# Altium schematic sheet SMPS-5V.SchDoc
size A
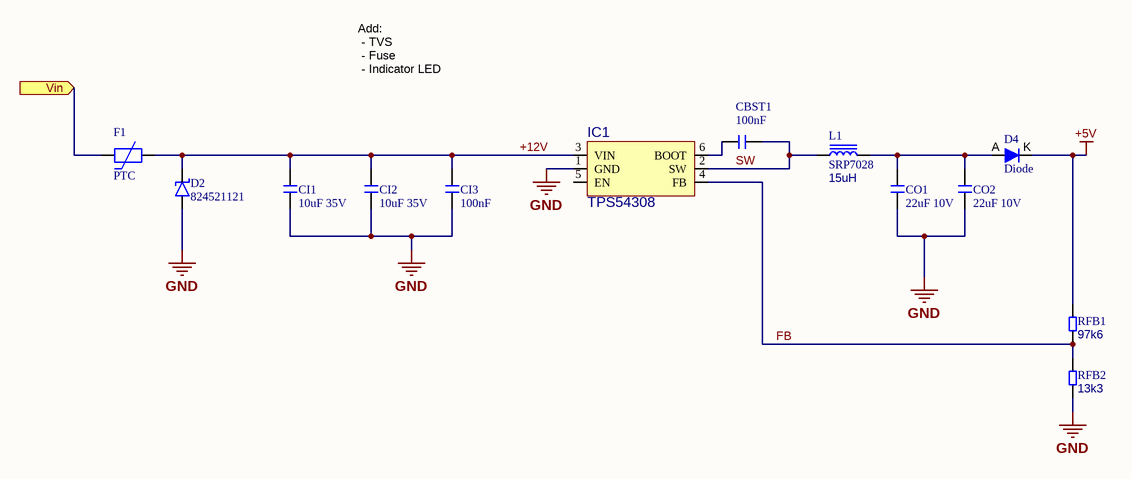
[diagram p0: SMPS-5V.SchDoc]

## Parts
CBST1  100nF  [C0603_N]
CI1  10uF 35V  [C1210_N]
CI2  10uF 35V  [C1210_N]
CI3  100nF  [C0603_N]
CO1  22uF 10V  [C1210_N]
CO2  22uF 10V  [C1210_N]
D2  824521121  [DO214AC SMA]
D4  Diode  [SOD323F]
F1  PTC  [C1206_N]
IC1  TPS54308  [SOT23]
L1  SRP7028  value 15uH  [Inductor SRP7028]
RFB1  value 97k6  [R0603]  (hidden comment: 100k)
RFB2  value 13k3  [R0603]  (hidden comment: 13k5)

## Ports
Vin (in)

## Nets
+5V: D4.K RFB1.2
GND: CI1.2 CI2.2 CI3.2 CO1.2 CO2.2 D2.1 IC1.1(GND) RFB2.1
+12V: CI1.1 CI2.1 CI3.1 D2.2 F1.2 IC1.3(VIN)
FB: IC1.4(FB) RFB1.1 RFB2.2
SW: CBST1.2 IC1.2(SW) L1.1
Vin: F1.1 ; port Vin
NetCBST1_1: CBST1.1 IC1.6(BOOT)
NetCO1_1: CO1.1 CO2.1 D4.A L1.2

Not connected (* = marked no-connect by the designer): IC1 5(EN)

## Notes on the sheet
- Add:
  - TVS
  - Fuse
  - Indicator LED

## Library data of the parts
CBST1 CI1 CI2 CO1 CO2 = Capacitor: Capacitor MLCC; Manufacturer: Yageo; Manufacturer Part Number: CC0603KRX7R9BB104; Tolerance (%): 10; Category: Capacitor; Package: 0603; Supplier Part Number 1: 1362556; Supplier 1: Farnell; ComponentLink1URL: http://www.yageo.com; ComponentLink1Description: Manufacturer Website; Supplier 2: Digi-Key; Supplier Part Number 2: 311-1344-1-ND
  CBST1: Value: 100nF; Voltage Rating (Volts): *
  CI1 CI2: Value: 10uF 35V; Voltage Rating (Volts): 35V
  CO1 CO2: Value: 22uF 10V; Voltage Rating (Volts): 10V
CI3 = Capacitor: Capacitor MLCC; Manufacturer: Yageo; Manufacturer Part Number: CC0603KRX7R9BB104; Tolerance (%): 10; Voltage Rating (Volts): 50V; Category: Capacitor; Package: 0603; Value: 100nF; Supplier Part Number 1: 1362556; Supplier 1: Farnell; ComponentLink1URL: http://www.yageo.com; ComponentLink1Description: Manufacturer Website; Supplier 2: Digi-Key; Supplier Part Number 2: 311-1344-1-ND
D2 = TVS
F1 = PTC: PTC, Resettable Fuse
IC1 = TPS54308: Buck Converter
L1 = Inductor
RFB1 RFB2 = Resistor: Published: 17-Dec-2003; LatestRevisionDate: 19-Mar-2004; LatestRevisionNote: Silkscreen size reduced.; PackageDocument: Mar-2003; PackageReference: 3-0603; Publisher: Altium Limited; Code_IPC: 1608 [0603]; ComponentLink1Description: Manufacturer Link; ComponentLink1URL: http://www.panasonic.com/industrial/components/resistive_products.htm; ComponentLink2Description: Datasheet; ComponentLink2URL: http://www.panasonic.com/industrial/components/pdf/AOA0000CE2.pdf